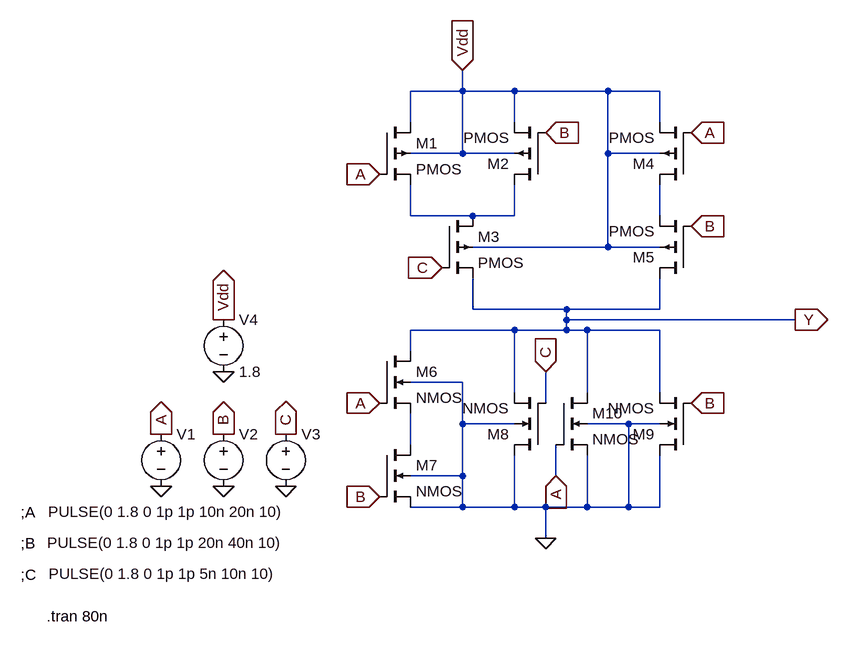
[diagram p0: schematic Task1.asc]
Task1.asc, the LTspice schematic file:
Version 4
SHEET 1 880 792
WIRE 192 -32 192 -64
WIRE 192 -32 112 -32
WIRE 272 -32 192 -32
WIRE 416 -32 272 -32
WIRE 496 -32 416 -32
WIRE 112 16 112 -32
WIRE 272 16 272 -32
WIRE 496 16 496 -32
WIRE 192 64 192 -32
WIRE 192 64 112 64
WIRE 272 64 192 64
WIRE 416 64 416 -32
WIRE 496 64 416 64
WIRE 112 160 112 112
WIRE 208 160 112 160
WIRE 272 160 272 112
WIRE 272 160 208 160
WIRE 496 160 496 112
WIRE 416 208 416 64
WIRE 416 208 208 208
WIRE 496 208 416 208
WIRE 208 304 208 256
WIRE 352 304 208 304
WIRE 496 304 496 256
WIRE 496 304 352 304
WIRE 352 320 352 304
WIRE 704 320 352 320
WIRE 272 336 112 336
WIRE 352 336 352 320
WIRE 352 336 272 336
WIRE 384 336 352 336
WIRE 496 336 384 336
WIRE 112 368 112 336
WIRE 192 416 112 416
WIRE 272 432 272 336
WIRE 384 432 384 336
WIRE 496 432 496 336
WIRE 320 448 320 400
WIRE 192 480 192 416
WIRE 272 480 192 480
WIRE 448 480 384 480
WIRE 496 480 448 480
WIRE 112 512 112 464
WIRE 192 560 192 480
WIRE 192 560 112 560
WIRE 336 560 336 512
WIRE 192 608 192 560
WIRE 192 608 112 608
WIRE 272 608 272 528
WIRE 272 608 192 608
WIRE 320 608 272 608
WIRE 384 608 384 528
WIRE 384 608 320 608
WIRE 448 608 448 480
WIRE 448 608 384 608
WIRE 496 608 496 528
WIRE 496 608 448 608
WIRE 320 656 320 608
FLAG 192 -64 Vdd
IOPIN 192 -64 In
FLAG 320 656 0
FLAG 64 96 A
IOPIN 64 96 In
FLAG 544 32 A
IOPIN 544 32 In
FLAG 64 448 A
IOPIN 64 448 In
FLAG 336 560 A
IOPIN 336 560 In
FLAG 320 400 C
IOPIN 320 400 In
FLAG 160 240 C
IOPIN 160 240 In
FLAG 320 32 B
IOPIN 320 32 In
FLAG 544 176 B
IOPIN 544 176 In
FLAG 544 448 B
IOPIN 544 448 In
FLAG 64 592 B
IOPIN 64 592 In
FLAG 704 320 Y
IOPIN 704 320 Out
FLAG -272 496 A
IOPIN -272 496 Out
FLAG -176 496 B
IOPIN -176 496 Out
FLAG -80 496 C
IOPIN -80 496 Out
FLAG -80 576 0
FLAG -176 576 0
FLAG -272 576 0
FLAG -176 400 0
FLAG -176 320 Vdd
IOPIN -176 320 Out
SYMBOL pmos4 64 16 R0
SYMATTR InstName M1
SYMBOL pmos4 320 112 R180
SYMATTR InstName M2
SYMBOL pmos4 160 160 R0
SYMATTR InstName M3
SYMBOL pmos4 544 112 R180
SYMATTR InstName M4
SYMBOL pmos4 544 256 R180
SYMATTR InstName M5
SYMBOL nmos4 64 368 R0
SYMATTR InstName M6
SYMBOL nmos4 64 512 R0
SYMATTR InstName M7
SYMBOL nmos4 320 528 R180
SYMATTR InstName M8
SYMBOL nmos4 544 528 R180
SYMATTR InstName M9
SYMBOL nmos4 336 432 R0
SYMATTR InstName M10
SYMBOL voltage -272 480 R0
WINDOW 3 -174 135 Left 2
WINDOW 123 0 0 Left 0
WINDOW 39 0 0 Left 0
SYMATTR Value PULSE(0 1.8 0 1p 1p 10n 20n 10)
SYMATTR InstName V1
SYMBOL voltage -176 480 R0
WINDOW 3 -271 183 Left 2
WINDOW 123 0 0 Left 0
WINDOW 39 0 0 Left 0
SYMATTR Value PULSE(0 1.8 0 1p 1p 20n 40n 10)
SYMATTR InstName V2
SYMBOL voltage -80 480 R0
WINDOW 3 -365 231 Left 2
WINDOW 123 0 0 Left 0
WINDOW 39 0 0 Left 0
SYMATTR Value PULSE(0 1.8 0 1p 1p 5n 10n 10)
SYMATTR InstName V3
SYMBOL voltage -176 304 R0
WINDOW 123 0 0 Left 0
WINDOW 39 0 0 Left 0
SYMATTR InstName V4
SYMATTR Value 1.8
TEXT -488 616 Left 2 !;A
TEXT -488 664 Left 2 !;B
TEXT -488 712 Left 2 !;C
TEXT -448 776 Left 2 !.tran 80n

The netlist it stands for:
* Task1.asc
M1 Vdd A N001 Vdd PMOS
M2 N001 B Vdd Vdd PMOS
M3 N001 C Y Vdd PMOS
M4 N002 A Vdd Vdd PMOS
M5 Y B N002 Vdd PMOS
M6 Y A N003 0 NMOS
M7 N003 B 0 0 NMOS
M8 0 C Y 0 NMOS
M9 0 B Y 0 NMOS
M10 Y A 0 0 NMOS
V1 A 0 PULSE(0 1.8 0 1p 1p 10n 20n 10)
V2 B 0 PULSE(0 1.8 0 1p 1p 20n 40n 10)
V3 C 0 PULSE(0 1.8 0 1p 1p 5n 10n 10)
V4 Vdd 0 1.8
.model NMOS NMOS
.model PMOS PMOS
.lib standard.mos
;A
;B
;C
.tran 80n
.backanno
.end